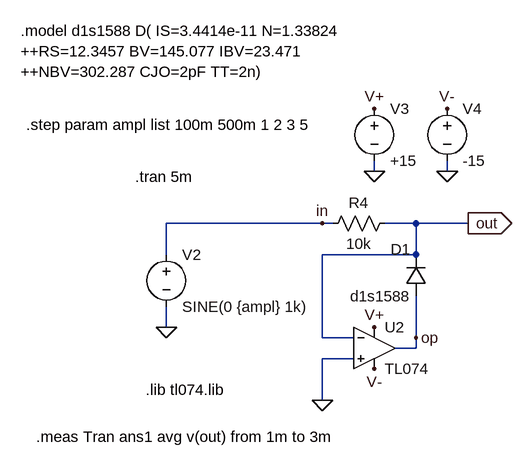
[diagram p0: schematic fig21.asc]
fig21.asc, the LTspice schematic file:
Version 4
SHEET 1 880 680
WIRE 368 64 368 48
WIRE 480 64 480 48
WIRE 288 144 48 144
WIRE 304 144 288 144
WIRE 432 144 384 144
WIRE 512 144 432 144
WIRE 48 192 48 144
WIRE 432 192 432 144
WIRE 432 192 288 192
WIRE 48 304 48 272
WIRE 288 320 288 192
WIRE 336 320 288 320
WIRE 432 320 432 256
WIRE 432 336 432 320
WIRE 432 336 400 336
WIRE 336 352 288 352
WIRE 288 416 288 352
FLAG 48 304 0
FLAG 288 416 0
FLAG 512 144 out
IOPIN 512 144 Out
FLAG 368 64 0
FLAG 480 64 0
FLAG 368 -32 V+
FLAG 480 -32 V-
FLAG 288 144 in
FLAG 368 304 V+
FLAG 368 368 V-
FLAG 432 320 op
SYMBOL res 288 160 R270
WINDOW 0 32 56 VTop 0
WINDOW 3 0 56 VBottom 0
SYMATTR InstName R4
SYMATTR Value 10k
SYMBOL voltage 48 176 R0
WINDOW 123 0 0 Left 0
WINDOW 39 0 0 Left 0
SYMATTR InstName V2
SYMATTR Value SINE(0 {ampl} 1k)
SYMBOL diode 448 256 R180
WINDOW 0 24 72 Left 0
WINDOW 3 24 0 Left 0
SYMATTR InstName D1
SYMATTR Value d1s1588
SYMBOL voltage 368 -48 R0
SYMATTR InstName V3
SYMATTR Value +15
SYMBOL voltage 480 -48 R0
SYMATTR InstName V4
SYMATTR Value -15
SYMBOL Opamps\\opamp2 368 272 R0
SYMATTR InstName U2
SYMATTR Value TL074
TEXT 16 400 Left 0 !.lib tl074.lib
TEXT 0 72 Left 0 !.tran 5m
TEXT -168 -8 Left 0 !.step param ampl list 100m 500m 1 2 3 5
TEXT -152 472 Left 0 !.meas Tran ans1 avg v(out) from 1m to 3m
TEXT -176 -152 Left 0 !.model d1s1588 D( IS=3.4414e-11 N=1.33824 \n++RS=12.3457 BV=145.077 IBV=23.471 \n++NBV=302.287 CJO=2pF TT=2n)

The netlist it stands for:
* fig21.asc
R4 in out 10k
V2 in 0 SINE(0 {ampl} 1k)
D1 op out d1s1588
V3 V+ 0 +15
V4 V- 0 -15
XU2 0 out V+ V- op TL074  ; pins In+ In- V+ V- OUT
.model D D
.lib standard.dio
.lib tl074.lib
.tran 5m
.step param ampl list 100m 500m 1 2 3 5
.meas Tran ans1 avg v(out) from 1m to 3m
.model d1s1588 D( IS=3.4414e-11 N=1.33824
++RS=12.3457 BV=145.077 IBV=23.471
++NBV=302.287 CJO=2pF TT=2n)
.backanno
.end